# Altium schematic sheet RP2040 MCU.SchDoc
size A3; SheetNumber: 5; SheetTotal: 14
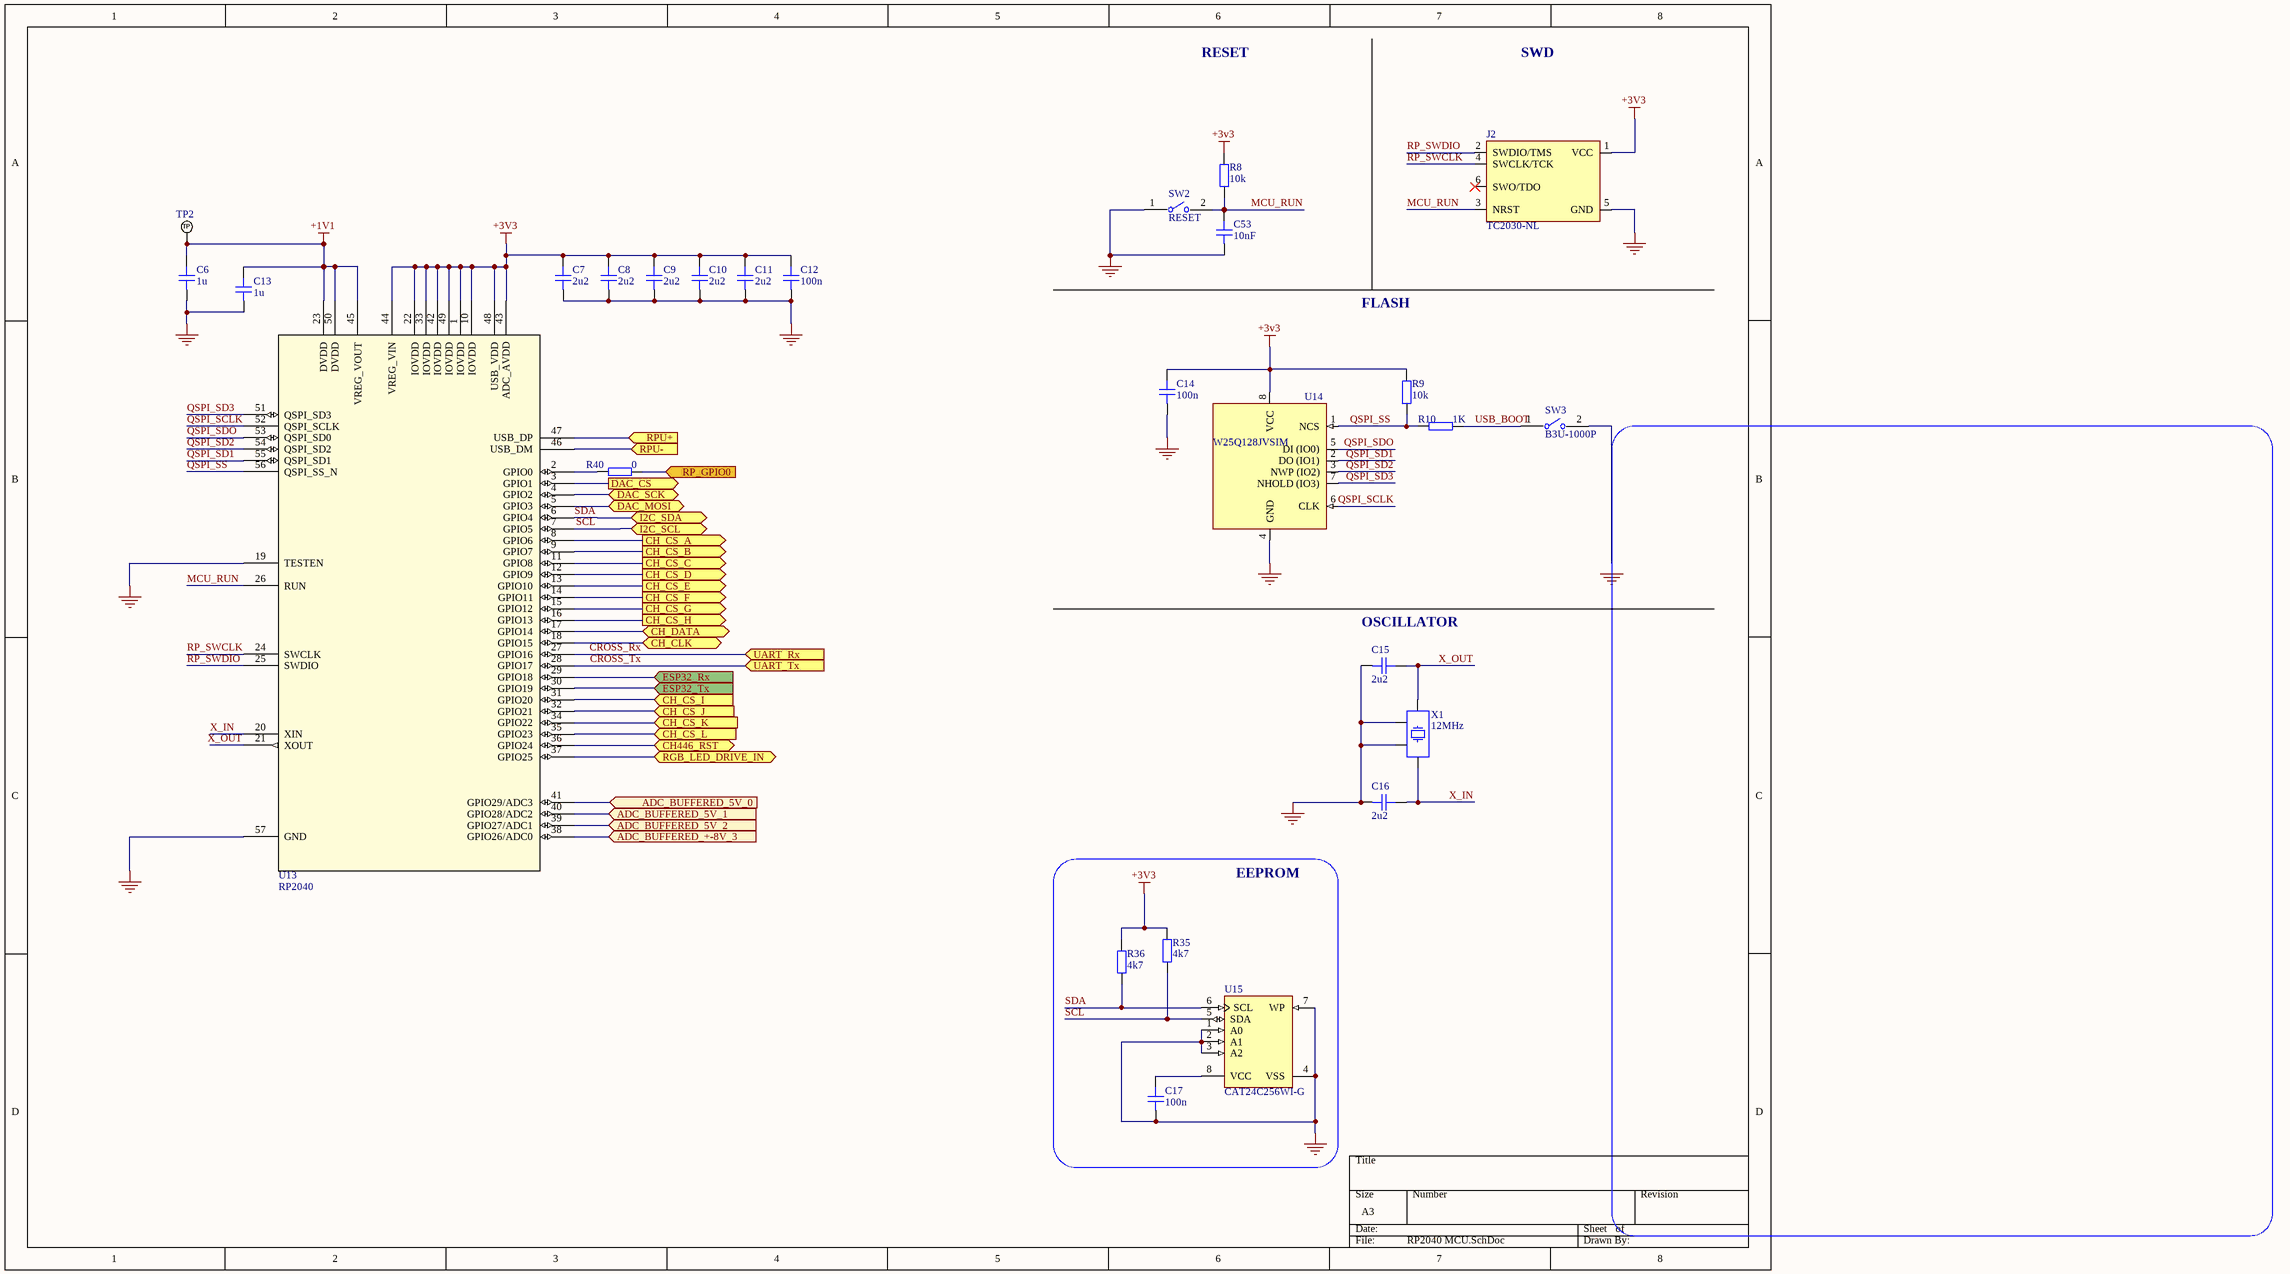
[diagram p0: RP2040 MCU.SchDoc]

## Parts
C6  1u  [CAP_0603]
C7  2u2  [CAP_0603]
C8  2u2  [CAP_0603]
C9  2u2  [CAP_0603]
C10  2u2  [CAP_0603]
C11  2u2  [CAP_0603]
C12  100n  [CAP_0603]
C13  1u  [CAP_0603]
C14  100n  [CAP_0603]
C15  2u2  [CAP_0603]
C16  2u2  [CAP_0603]
C17  100n  [CAP_0603]
C53  10nF  [CAP_0603]
J2  TC2030-NL  [TC2030-NL-FP]  (no BOM)
R8  10k  [RES_0603]
R9  10k  [RES_0603]
R10  1K  [RES_0603]
R35  4k7  [RES_0603]
R36  4k7  [RES_0603]
R40  0  [RES_0603]
SW2  RESET  [FP-B3U-1000P-MFG]
SW3  B3U-1000P  [FP-B3U-1000P-MFG]
TP2  TP_NOBOM  [PAD_RND_1MM]  (value not drawn)  (no BOM)
U13  RP2040  [IC57_RP2040]
U14  W25Q128JVSIM  [SOIC-8]
U15  CAT24C256WI-G  [ONSC-SOIC-8-751BD-01_L]
X1  12MHz  [XTAL_3225]

## Blocks framed on the sheet
EEPROM: C17 R35 R36 U15

## Ports
ADC_BUFFERED_5V_0 (in), ADC_BUFFERED_5V_1 (in), ADC_BUFFERED_5V_2 (in), ADC_BUFFERED_+-8V_3 (in), CH446_RST (bidir), CH_CLK (bidir), CH_CS_A (out), CH_CS_B (out), CH_CS_C (out), CH_CS_D (out), CH_CS_E (out), CH_CS_F (out), CH_CS_G (out), CH_CS_H (out), CH_CS_I (in), CH_CS_J (in), CH_CS_K (in), CH_CS_L (in), CH_DATA (bidir), DAC_CS (out), DAC_MOSI (bidir), DAC_SCK (bidir), ESP32_Rx (in), ESP32_Tx (in), I2C_SCL (bidir), I2C_SDA (bidir), RGB_LED_DRIVE_IN (bidir), RP_GPIO0 (in), RPU+ (in), RPU- (in), UART_Rx (in), UART_Tx (in)

## Nets
+1V1: C6.2 C13.2 TP2.1(TP) U13.23(DVDD) U13.45(VREG_VOUT) U13.50(DVDD)
+3v3: C7.2 C8.2 C9.2 C10.2 C11.2 C12.2 C14.2 J2.1(VCC) R8.2 R9.2 R35.2 R36.2 U13.1(IOVDD) U13.10(IOVDD) U13.22(IOVDD) U13.33(IOVDD) U13.42(IOVDD) U13.43(ADC_AVDD) U13.44(VREG_VIN) U13.48(USB_VDD) U13.49(IOVDD) U14.8(VCC)
GND: C6.1 C7.1 C8.1 C9.1 C10.1 C11.1 C12.1 C13.1 C14.1 C15.1 C16.1 C17.1 C53.1 J2.5(GND) SW2.1 SW3.2 U13.19(TESTEN) U13.57(GND) U14.4(GND) U15.1(A0) U15.2(A1) U15.3(A2) U15.4(VSS) U15.7(WP) X1.2 X1.4
ADC_BUFFERED_5V_0: U13.41(GPIO29/ADC3) ; port ADC_BUFFERED_5V_0
ADC_BUFFERED_5V_1: U13.40(GPIO28/ADC2) ; port ADC_BUFFERED_5V_1
ADC_BUFFERED_5V_2: U13.39(GPIO27/ADC1) ; port ADC_BUFFERED_5V_2
ADC_BUFFERED_+-8V_3: U13.38(GPIO26/ADC0) ; port ADC_BUFFERED_+-8V_3
CH446_RST: U13.36(GPIO24) ; port CH446_RST
CH_CLK: U13.18(GPIO15) ; port CH_CLK
CH_CS_A: U13.8(GPIO6) ; port CH_CS_A
CH_CS_B: U13.9(GPIO7) ; port CH_CS_B
CH_CS_C: U13.11(GPIO8) ; port CH_CS_C
CH_CS_D: U13.12(GPIO9) ; port CH_CS_D
CH_CS_E: U13.13(GPIO10) ; port CH_CS_E
CH_CS_F: U13.14(GPIO11) ; port CH_CS_F
CH_CS_G: U13.15(GPIO12) ; port CH_CS_G
CH_CS_H: U13.16(GPIO13) ; port CH_CS_H
CH_CS_I: U13.31(GPIO20) ; port CH_CS_I
CH_CS_J: U13.32(GPIO21) ; port CH_CS_J
CH_CS_K: U13.34(GPIO22) ; port CH_CS_K
CH_CS_L: U13.35(GPIO23) ; port CH_CS_L
CH_DATA: U13.17(GPIO14) ; port CH_DATA
CROSS_Rx: U13.27(GPIO16) ; port UART_Rx
CROSS_Tx: U13.28(GPIO17) ; port UART_Tx
DAC_CS: U13.3(GPIO1) ; port DAC_CS
DAC_MOSI: U13.5(GPIO3) ; port DAC_MOSI
DAC_SCK: U13.4(GPIO2) ; port DAC_SCK
ESP32_Rx: U13.29(GPIO18) ; port ESP32_Rx
ESP32_Tx: U13.30(GPIO19) ; port ESP32_Tx
MCU_RUN: C53.2 J2.3(NRST) R8.1 SW2.2 U13.26(RUN)
QSPI_SCLK: U13.52(QSPI_SCLK) U14.6(CLK)
QSPI_SD1: U13.55(QSPI_SD1) U14.2(DO_(IO1))
QSPI_SD2: U13.54(QSPI_SD2) U14.3(NWP_(IO2))
QSPI_SD3: U13.51(QSPI_SD3) U14.7(NHOLD_(IO3))
QSPI_SDO: U13.53(QSPI_SD0) U14.5(DI_(IO0))
QSPI_SS: R9.1 R10.1 U13.56(QSPI_SS_N) U14.1(NCS)
RGB_LED_DRIVE_IN: U13.37(GPIO25) ; port RGB_LED_DRIVE_IN
RP_GPIO0: R40.1 ; port RP_GPIO0
RP_SWCLK: J2.4(SWCLK/TCK) U13.24(SWCLK)
RP_SWDIO: J2.2(SWDIO/TMS) U13.25(SWDIO)
RPU+: U13.47(USB_DP) ; port RPU+
RPU-: U13.46(USB_DM) ; port RPU-
SCL: R35.1 U13.7(GPIO5) U15.5(SDA) ; port I2C_SCL
SDA: R36.1 U13.6(GPIO4) U15.6(SCL) ; port I2C_SDA
USB_BOOT: R10.2 SW3.1
X_IN: C16.2 U13.20(XIN) X1.3
X_OUT: C15.2 U13.21(XOUT) X1.1
NetC17_2: C17.2 U15.8(VCC)
NetR40_2: R40.2 U13.2(GPIO0)

Not connected (* = marked no-connect by the designer): J2 6(SWO/TDO)*

## Notes on the sheet
- RESET
- SWD
- FLASH
- (near C15) OSCILLATOR

## Library data of the parts
C6-C17 C53 = CAP_0603: Capacitor SMD 0603; Manufacturer: *; Manufacturer Part Number: *; Distributor Link: *; LCSC: *; Rating: *; Dielectric: *
J2 = TC2030-NL: Tag-Connect No-Solder SWD Debug Connector (No Legs) DO NOT PLACE; Manufacturer: Tag-Connect; Manufacturer Part Number: TC2030-NL-FP
R8-R10 R35 R36 R40 = RES_0603: Resistor SMD 0603; Manufacturer: *; Manufacturer Part Number: *; Distributor Link: *; LCSC: *
SW2 SW3 = CMP-2100-03586-2: SWITCH TACTILE SPST-NO 0.05A 12V; Contact Resistance: 100mR; Operating Force: 1.5N; Max Current Rating: 50mA; Switch Travel: 0.15mm; Actuator Type: Standard; Mechanical Life: 200000Cycles; Ratings: Dust Proof; Illumination Type: Non-Illuminated; Throw Configuration: SPST; Actuator Length: 0.4mm; Switch Function: Off-Mom; Height: 1.2mm; Width: 3mm; Weight: 0.000776oz; Contact Material: Silver; Max Voltage Rating (DC): 12V; Insulation Resistance: 100MR; Lead Free: Lead Free; Current Rating: 50mA; Termination: SMD/SMT; Length: 4mm; Voltage Rating (DC): 12V; Contact Current Rating: 50mA; Orientation: Straight; Depth: 2.5mm; Max Operating Temperature: 70°C; Packaging: Tape and Reel; Min Operating Temperature: -25°C; Package Quantity: 1; Mount: Surface Mount; Electrical Life: 200000Cycles
TP2 = TEST_POINT_RND_1MM: Test Point Round 1mm (NO BOM)
U13 = RP2040: No Description Available; Manufacturer_Name: Raspberry Pi; Copyright: Copyright (C) 2025 Ultra Librarian. All rights reserved.; Manufacturer_Part_Number: RP2040; RefDes: RefDes; Type: Type
U14 = W25Q128JVSIM: 128M-BIT / SERIAL FLASH MEMORY WITH / DUAL/QUAD SPI & QPI & DTR SOIC-8; Manufacturer: Winbond; Manufacturer Part Number: W25Q128JVSIM
U15 = CMP-2000-06068-1: I2C CMOS Serial EEPROM, 1.8 to 5.5 V, -40 to 85 degC, 8-Pin SOIC, RoHS, Tube; Manufacturer: ON Semiconductor; Operating Supply Voltage (Max): 5.5V; Frequency (Max): 0.1MHz; Operating Supply Voltage (Typ): 2.5/3.3/5V; Supply Current: 1mA; Data Retention: 100; Organization: 32Kx8; Programmable: Yes; Operating Supply Voltage (Min): 1.8V; Access Time (Max): 3500ns; Density: 262144Bit; Interface Type: Serial(I2C); DELETED: Compliant; Rad Hardened: No; Package Reference: SOIC-8-751BD-01; Manufacturer URL: http://www.onsemi.com/; Package Type: SOICN; Operating Temperature Classification: Industrial; Datasheet Version: Rev. 14, 01/2014; Datasheet URL: http://www.onsemi.com/pub_link/Collateral/CAT24C256-D.PDF; Operating Temp Range: -40Cto85C; Mounting: SurfaceMount; Package Description: 8-Pin Small Outline Integrated Circuit, Body 4.9 x 3.9 mm, Pitch 1.27 mm; Pin Count: 8; Operating Temperature (Max): 85C; Operating Temperature (Min): -40C; Frequency: 0.1MHz; Write Protection: Yes; Mounting Technology: SurfaceMount; Package URL: http://www.onsemi.com/pub_link/Collateral/751BD.PDF
X1 = TSX-3225_24.0000MF15X-AC: Crystal SMD 24MHz 10PPM 7pF 3225; Manufacturer: Epson; Manufacturer Part Number: TSX-3225 24.0000MF15X-AC